# EAGLE design mcc (EAGLE 9.5.1)
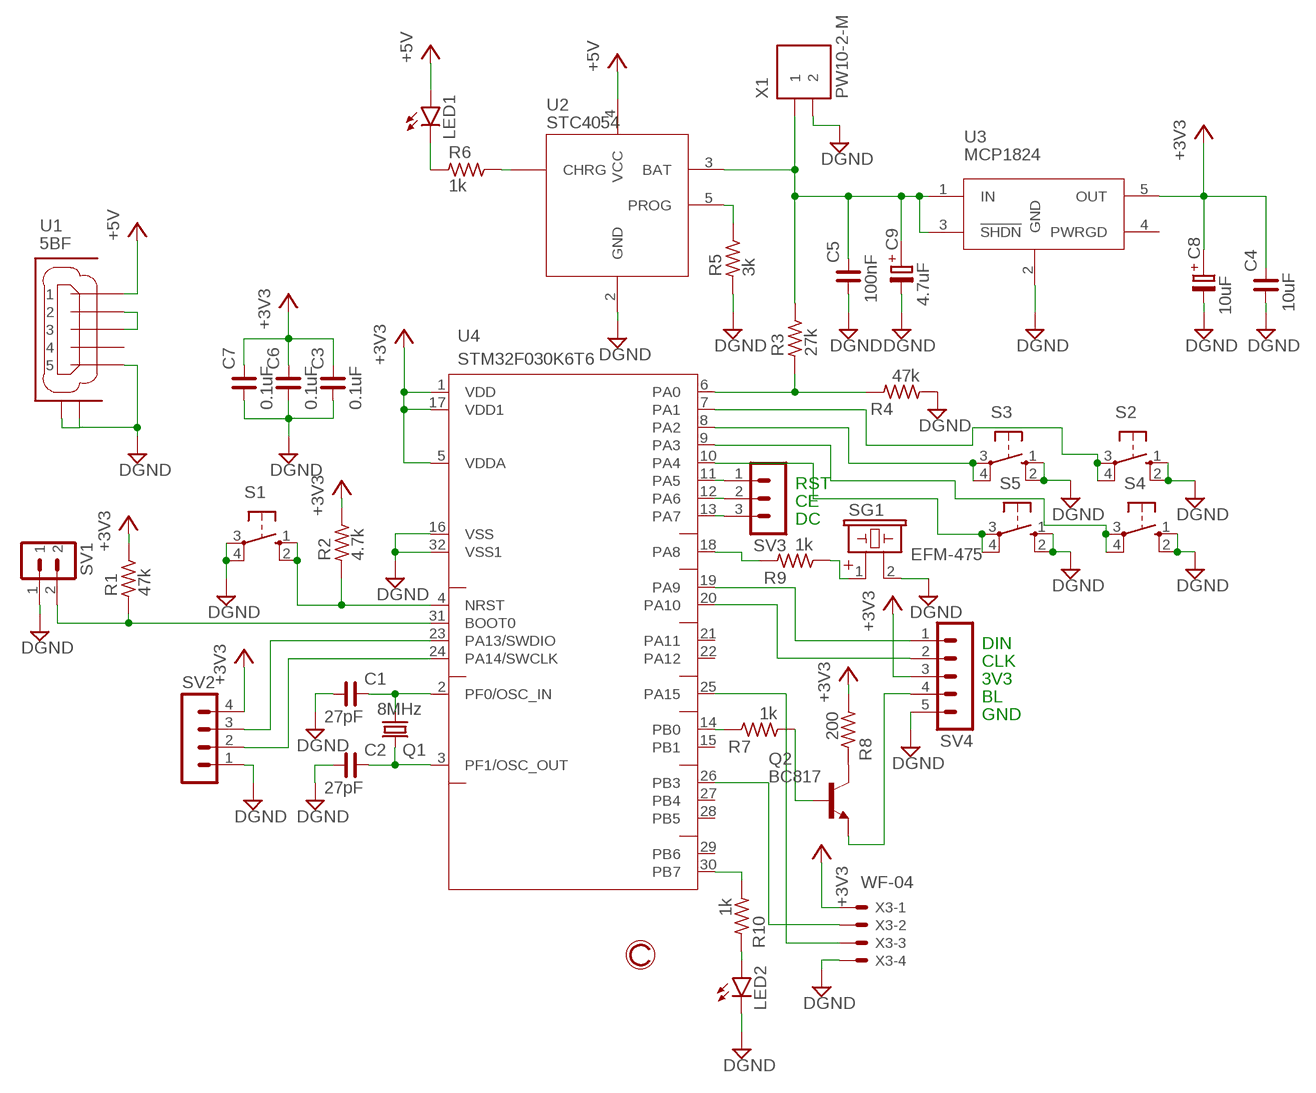
[diagram p0: schematic, sheet 1]

## Parts
C1  27pF  C_0805  [C0805]
C2  27pF  C_0805  [C0805]
C3  0.1uF  C_0805  [C0805]
C4  10uF  C_1206  [C1206]
C5  100nF  C_0805  [C0805]
C6  0.1uF  C_0805  [C0805]
C7  0.1uF  C_0805  [C0805]
C8  10uF  C-PR-SMD-SV-C  [SV-C]
C9  4.7uF  C-PR-SMD-SV-C  [SV-C]
LED1  LEDSML0805  [SML0805]
LED2  LEDSML0805  [SML0805]
Q1  8MHz  CRYSTALHC49UP  [HC49UP]
Q2  BC817  BC817-40SMD  [SOT23-BEC]
R1  47k  R_0805  [R0805]
R2  4.7k  R_0805  [R0805]
R3  27k  R_0805  [R0805]
R4  47k  R_0805  [R0805]
R5  3k  R_0805  [R0805]
R6  1k  R_0805  [R0805]
R7  1k  R_0805  [R0805]
R8  200  R_0805  [R0805]
R9  1k  R_0805  [R0805]
R10  1k  R_0805  [R0805]
S1  10-XX  [B3F-10XX]
S2  10-XX  [B3F-10XX]
S3  10-XX  [B3F-10XX]
S4  10-XX  [B3F-10XX]
S5  10-XX  [B3F-10XX]
SG1  EFM-475  [EFM-472]
SV1  MA02-1  [MA02-1]
SV2  MA04-1  [MA04-1]
SV3  MA03-1  [MA03-1]
SV4  MA05-1  [MA05-1]
U1  5BF  MICRO-USB-5BF  [MICRO-USB-5BF]
U2  STC4054  [SOT23-5L]
U3  MCP1824  [SOT23-5L]
U4  STM32F030K6T6  [LQFP-32]
X1  PW10-2-M  MKS1852-6-0-202  [MKS1852-6-0-202]
X3  WF-04  22-23-2041  [22-23-2041]

## Nets
+3V3: C3.2 C4.2 C6.2 C7.2 C8.+ R1.2 R2.2 R8.1 SV2.4 SV4.3 U3.5(OUT) U4.1(VDD) U4.5(VDDA) U4.17(VDD1) X3.1
BAT: C5.2 C9.+ R3.2 U2.3(BAT) U3.1(IN) U3.3(!SHDN) X1.1
BL: R7.2 U4.14(PB0)
BOOT0: R1.1 SV1.2 U4.31(BOOT0)
BUZZER: R9.2 U4.18(PA8)
CE: SV3.2 U4.12(PA6)
CHRG: R6.2 U2.1(CHRG)
CLK: SV4.2 U4.20(PA10)
DATA: U4.26(PB3) X3.2
DC: SV3.3 U4.13(PA7)
DGND: C1.1 C2.1 C3.1 C4.1 C5.1 C6.1 C7.1 C8.- C9.- LED2.C R4.1 R5.1 S1.3(P) S1.4(P1) S2.1(S) S2.2(S1) S3.1(S) S3.2(S1) S4.1(S) S4.2(S1) S5.1(S) S5.2(S1) SG1.2 SV1.1 SV2.1 SV4.5 U1.5 U1.GND1 U1.GND2 U2.2(GND) U3.2(GND) U4.16(VSS) U4.32(VSS1) X1.2 X3.4
DIN: SV4.1 U4.19(PA9)
DIV_BAT: R3.1 R4.2 U4.6(PA0)
LED2: R10.1 U4.30(PB7)
N$18: U4.25(PA15) X3.3
N$29: U1.2 U1.3
NRST: R2.1 S1.1(S) S1.2(S1) U4.4(NRST)
PF0-OSC_IN: C1.2 Q1.1 U4.2(PF0/OSC_IN)
PF1-OSC_OUT: C2.2 Q1.2 U4.3(PF1/OSC_OUT)
PROG: R5.2 U2.5(PROG)
R_+3V3: Q2.C R8.2
R_BL: Q2.B R7.1
R_BUZZER: R9.1 SG1.1
R_CHRG: LED1.C R6.1
R_LED2: LED2.A R10.2
RST: SV3.1 U4.11(PA5)
S2: S2.3(P) S2.4(P1) U4.7(PA1)
S3: S3.3(P) S3.4(P1) U4.8(PA2)
S4: S4.3(P) S4.4(P1) U4.9(PA3)
S5: S5.3(P) S5.4(P1) U4.10(PA4)
SWCLK: SV2.2 U4.24(PA14/SWCLK)
SWDIO: SV2.3 U4.23(PA13/SWDIO)
VCC: LED1.A U1.1 U2.4(VCC) ; supply symbol labelled +5V
Е_BL: Q2.E SV4.4
Unconnected: U1.4 U3.4(PWRGD) U4.15(PB1) U4.21(PA11) U4.22(PA12) U4.27(PB4) U4.28(PB5) U4.29(PB6)

## Notes on the sheet
- RST
- CE
- DC
- DIN
- CLK
- 3V3
- BL
- GND

## Library data of the parts
C1-C7 = rc-master-smd:C_: NON-POLARIZED CAP
C8 C9 = mcc:C-PR: POLARIZED ELECTROLYTIC/TANTALUM
LED1 LED2 = mcc:LED: LED OSRAM: - CHIPLED LG R971, LG N971, LY N971, LG Q971, LY Q971, LO R971, LY R971 LH N974, LH R974 LS Q976, LO Q976, LY Q976 LO Q996 - Hyper CHIPLED LW Q18S LB Q993, LB Q99A, LB R99A - SideLED LS A670, LO A670, LY A670, LG A670, LP A670 LB A673, LV A673, LT A673, LW A673 LH A674 LY A675 LS A676, LA A676, LO A676, LY A676, LW A676 LS A679, LY A679, LG A679 - Hyper Micro SIDELED® LS Y876, LA Y876, LO Y876, LY Y876 LT Y87S - SmartLED LW L88C, LW L88S LB L89C, LB L89S, LG L890 LS L89K, LO L89K, LY L89K LS L896, LA L896, LO L896, LY L896 - TOPLED LS T670, LO T670, LY T670, LG T670, LP T670 LSG T670, LSP T670, LSY T670, LOP T670, LYG T670 LG T671, LOG T671, LSG T671 LB T673, LV T673, LT T673, LW T673 LH T674 LS T676, LA T676, LO T676, LY T676, LB T676, LH T676, LSB T676, LW T676 LB T67C, LV T67C, LT T67C, LS T67K, LO T67K, LY T67K, LW E67C LS E67B, LA E67B, LO E67B, LY E67B, LB E67C, LV E67C, LT E67C LW T67C LS T679, LY T679, LG T679 LS T770, LO T770, LY T770, LG T770, LP T770 LB T773, LV T773, LT T773, LW T773 LH T774 LS E675, LA E675, LY E675, LS T675 LS T776, LA T776, LO T776, LY T776, LB T776 LHGB T686 LT T68C, LB T68C - Hyper Mini TOPLED® LB M676 - Mini TOPLED Santana® LG M470 LS M47K, LO M47K, LY M47K Source: http://www.osram.convergy.de LUXEON: - LUMILED® LXK2-PW12-R00, LXK2-PW12-S00, LXK2-PW14-U00, LXK2-PW14-V00 LXK2-PM12-R00, LXK2-PM12-S00, LXK2-PM14-U00 LXK2-PE12-Q00, LXK2-PE12-R00, LXK2-PE12-S00, LXK2-PE14-T00, LXK2-PE14-U00 LXK2-PB12-K00, LXK2-PB12-L00, LXK2-PB12-M00, LXK2-PB14-N00, LXK2-PB14-P00, LXK2-PB14-Q00 LXK2-PR12-L00, LXK2-PR12-M00, LXK2-PR14-Q00, LXK2-PR14-R00 LXK2-PD12-Q00, LXK2-PD12-R00, LXK2-PD12-S00 LXK2-PH12-R00, LXK2-PH12-S00 LXK2-PL12-P00, LXK2-PL12-Q00, LXK2-PL12-R00 Source: www.luxeon.com KINGBRIGHT: KA-3528ASYC Source: www.kingbright.com
Q1 = mcc:CRYSTAL: CRYSTAL; OC_FARNELL: unknown; OC_NEWARK: unknown
Q2 = mcc:BC817*: NPN Transistor
R1-R10 = rc-master-smd:R_: RESISTOR
S1-S5 = mcc:10-XX: OMRON SWITCH; MPN: B3F-1000; OC_FARNELL: 176432; OC_NEWARK: 36M3542
SG1 = mcc:EFM-475: BUZZER Source: Buerklin
SV1 = mcc:MA02-1: PIN HEADER
SV2 = mcc:MA04-1: PIN HEADER; OC_FARNELL: unknown; OC_NEWARK: unknown
SV3 = mcc:MA03-1: PIN HEADER; OC_FARNELL: unknown; OC_NEWARK: unknown
SV4 = mcc:MA05-1: PIN HEADER; OC_FARNELL: unknown; OC_NEWARK: unknown
U1 = mcc:MICRO-USB-5BF: Micro USB B connector
U2 = mcc:STC4054
U3 = mcc:MCP1824
U4 = mcc:STM32F030K6T6
X1 = mcc:MKS1852-6-0-202: Serie MKS 1850 Lötstifte In-line, Raster 2.5 mm, Stiftwannen, stehend, mit Rastlasche Source: http://www.stocko.de/de/index.php?seite=ka_rfk2_mks1850.html&rubrik=Katalog+-+RFK+2 rfk_1850.pdf; OC_FARNELL: unknown; OC_NEWARK: unknown
X3 = mcc:22-23-2041: .100" (2.54mm) Center Header - 4 Pin; MF: MOLEX; MPN: 22-23-2041; OC_FARNELL: 1462920; OC_NEWARK: 38C0355

## Board
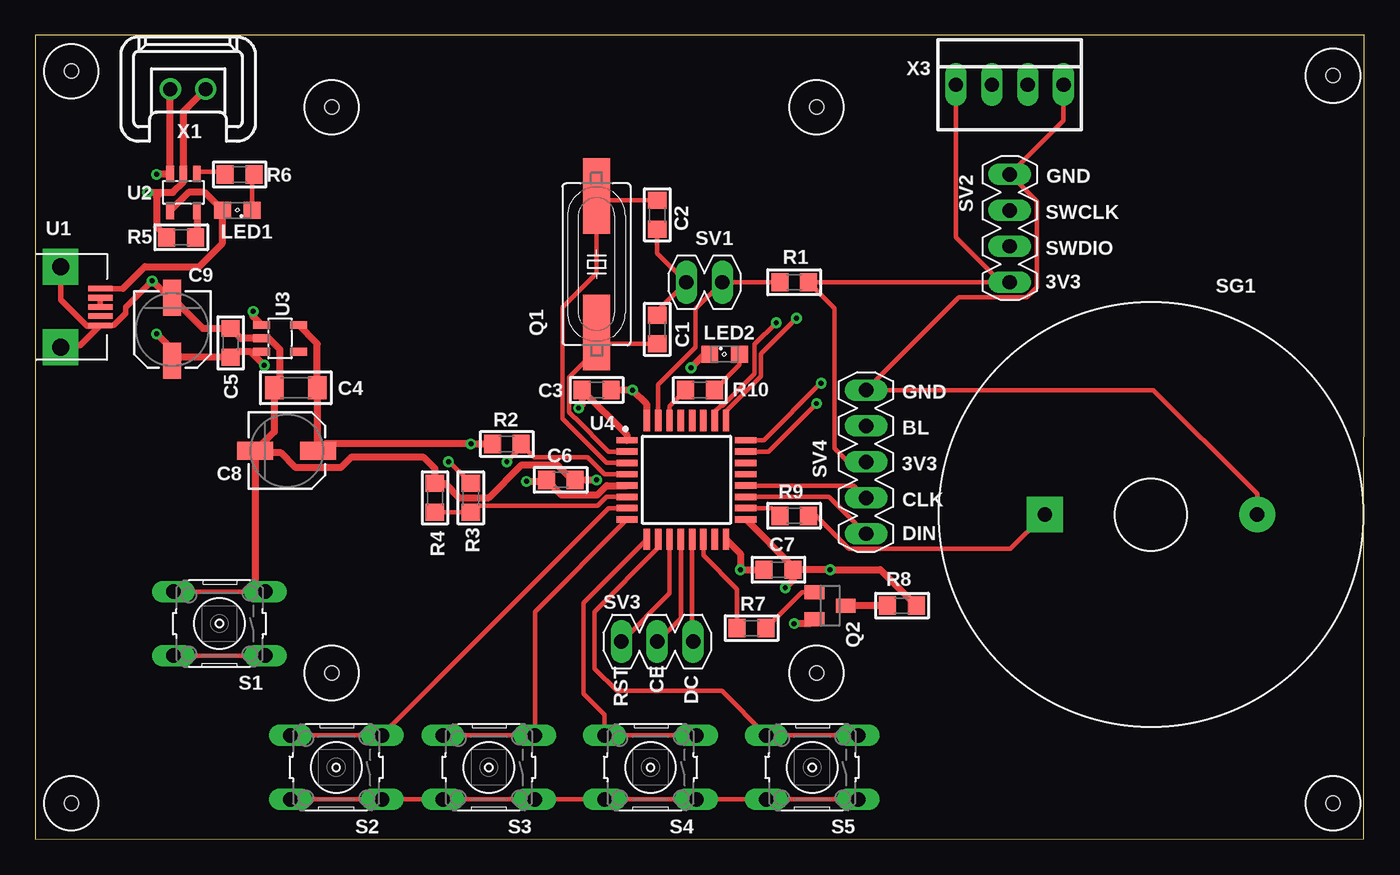
[diagram p1: board, top side]
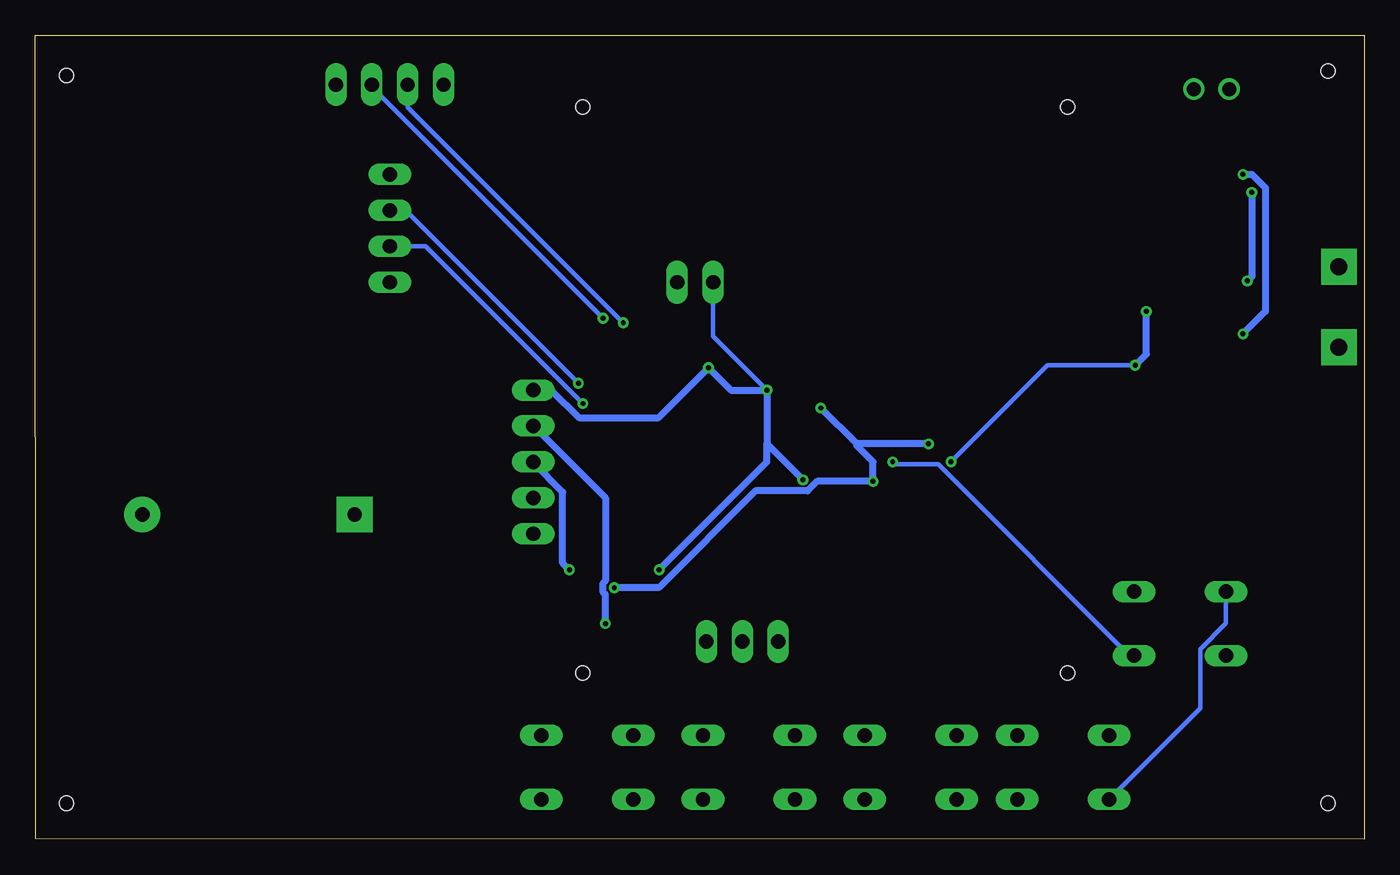
[diagram p2: board, bottom side, seen from below]

Size 93.96 x 56.82 mm. Coordinates in mm from the lower left corner, seen from the top.
Outline: 0,0 93.94,0.04 93.96,56.82 0,56.82 0,0
Copper layers (1*16): Top 0.035mm / dielectric 1.5mm / Bottom 0.035mm
Design rules "default": minimum track width 6mil, minimum drill 0.35mm, track to track 6mil, track to pad 6mil, pad to pad 6mil, via to via 6mil, smd to smd 6mil, copper to edge 40mil, drill to drill 6mil, minimum pad ring 10mil, minimum via ring 8mil, stop-mask expansion 4mil, vias tented up to drill 0mil, thermal gap 10mil
Holes 1 mm at 20.96,11.75 55.25,11.75 55.25,51.75 20.96,51.75 2.54,54.29 91.76,53.97 91.76,2.54 2.54,2.54

### Footprints (pad centres in the part's own frame; a part is rotated, then mirrored left to right if it is on the bottom)
C0805 = smd 1.2 x 1.3: 1 -1.016,0; 2 1.016,0
C1206 = smd 1.3 x 1.6: 1 -1.524,0; 2 1.524,0
SV-C = smd 2.54 x 1.27: + -2.223,0; - 2.223,0
SML0805 = smd 1.2 x 1.2: A 1.05,0; C -1.05,0
HC49UP = smd 5.334 x 1.93: 1 -4.826,0; 2 4.826,0
SOT23-BEC = smd 1 x 1.4: B -0.95,-1.1; C 0,1.1; E 0.95,-1.1
R0805 = smd 1.2 x 1.3: 1 -1.016,0; 2 1.016,0
B3F-10XX = drill 1.016 long: 1 -3.251,2.261; 2 3.251,2.261; 3 -3.251,-2.261; 4 3.251,-2.261
EFM-472 = drill 1 pad 2.54 square: 1 -7.504,0 | drill 1 pad 2.54: 2 7.504,0
MA02-1 = drill 1.016 long: 1 -2.54,0; 2 0,0
MA04-1 = drill 1.016 long: 1 -3.81,0; 2 -1.27,0; 3 1.27,0; 4 3.81,0
MA03-1 = drill 1.016 long: 1 -2.54,0; 2 0,0; 3 2.54,0
MA05-1 = drill 1.016 long: 1 -5.08,0; 2 -2.54,0; 3 0,0; 4 2.54,0; 5 5.08,0
MICRO-USB-5BF = smd 0.4 x 1.75: 1 -1.3,4.525; 2 -0.65,4.525; 3 0,4.525; 4 0.65,4.525; 5 1.3,4.525 | drill 1.2 pad 2.54 square: GND1 -2.855,1.7; GND2 2.855,1.7
SOT23-5L = smd 0.55 x 1.2: 1 -0.95,-1.3; 2 0,-1.3; 3 0.95,-1.3; 4 0.95,1.3; 5 -0.95,1.3
LQFP-32 = smd 0.45 x 1.5: 1 2.28,0.88; 2 3.08,0.88; 3 3.88,0.88; 4 4.68,0.88; 5 5.48,0.88; 6 6.28,0.88; 7 7.08,0.88; 8 7.88,0.88; 17 7.88,9.28; 18 7.08,9.28; 19 6.28,9.28; 20 5.48,9.28; 21 4.68,9.28; 22 3.88,9.28; 23 3.08,9.28; 24 2.28,9.28 | smd 1.5 x 0.45: 9 9.28,2.28; 10 9.28,3.08; 11 9.28,3.88; 12 9.28,4.68; 13 9.28,5.48; 14 9.28,6.28; 15 9.28,7.08; 16 9.28,7.88; 25 0.88,7.88; 26 0.88,7.08; 27 0.88,6.28; 28 0.88,5.48; 29 0.88,4.68; 30 0.88,3.88; 31 0.88,3.08; 32 0.88,2.28
MKS1852-6-0-202 = drill 1 pad 1.422: 1 -1.25,0; 2 1.25,0
22-23-2041 = drill 1 long: 1 -3.81,0; 2 -1.27,0; 3 1.27,0; 4 3.81,0

### Placement (x,y rotation side)
C1  43.97,36.04 270 top
C2  43.97,44.13 90 top
C3  39.69,31.75 180 top
C4  18.42,31.91 0 top
C5  13.81,35.08 270 top
C6  37.15,25.4 180 top
C7  52.55,19.05 0 top
C8  17.78,27.46 180 top
C9  9.68,36.04 90 top
LED1  14.29,44.45 180 top
LED2  48.74,34.29 0 top
Q1  39.69,40.64 90 top
Q2  56.2,16.51 270 top
R1  53.66,39.37 0 top
R2  33.34,27.94 180 top
R3  30.8,24.13 90 top
R4  28.26,24.13 270 top
R5  10.32,42.55 0 top
R6  14.45,46.99 180 top
R7  50.64,14.92 180 top
R8  61.28,16.51 180 top
R9  53.66,22.86 180 top
R10  46.99,31.75 0 top
S1  13.02,15.24 180 top
S2  21.27,5.08 180 top
S3  32.07,5.08 180 top
S4  43.5,5.08 180 top
S5  54.93,5.08 180 top
SG1  78.89,22.95 0 top
SV1  48.58,39.37 0 top
SV2  68.9,43.18 270 top
SV3  43.97,13.97 0 top
SV4  58.74,26.67 90 top
U1  0.08,37.62 270 top
U2  10.48,45.72 180 top
U3  17.3,35.4 270 top
U4  40.96,30.48 270 top
X1  10.79,53.02 0 top
X3  68.9,53.34 0 top

### Tracks (layer width: path | path; a pad name or v marks a point on that pad's centre or on a via)
+3V3  (via drill 0.35)
  Top 0.152: 59.75,19.05 59.8,19 | 36.24,25.29 C6.2
  Top 0.305: SV4.3 57.47,26.67 56.52,27.62 56.52,37.53 R1.2 SV2.4 68.26,39.37 65.09,42.55 X3.1
  Top 0.508: v38.42,30.48 38.67,30.73 C3.2 41.84,28.58 U4.1 | v34.72,25.29 36.24,25.29 | U4.5 40.4,25 39.74,24.34 37.19,24.34 C6.2 | C7.2 53.56,18.32 v53.02,17.78 | 59.8,19 R8.1 | U3.5 19.94,35.02 C4.2 19.94,27.53 C8.+ 20.48,27.94 v30.8,27.94 R2.2 | U4.17 53.56,19.27 C7.2 | C7.2 v56.2,19.05 59.75,19.05
  Bottom 0.152: 35.88,27.94 34.72,26.78 34.72,26.67 | 58.74,26.61 SV4.3
  Bottom 0.508: v56.2,19.05 56.67,19.52 56.67,24.54 58.74,26.61 | 35.88,27.94 v38.42,30.48 | 35.88,27.94 35.88,27.83 34.72,26.67 v34.72,25.29 38.69,25.29 39.36,24.61 43.04,24.61 49.88,17.78 v53.02,17.78 | v30.8,27.94 35.88,27.94
BAT  (via drill 0.35)
  Top 0.152: 30.51,25.43 R3.2
  Top 0.305: v29.21,26.68 29.26,26.68 30.51,25.43
  Top 0.508: 9.94,34.07 C5.2 14.19,34.45 15.24,34.45 | 9.94,34.07 C9.+ | 15.24,34.45 U3.3 | v16.19,33.5 15.24,34.45 | v8.57,35.72 9.94,34.35 9.94,34.07 | v15.4,37.31 15.4,36.96 U3.1 | v8.57,46.99 9.5,46.99 U2.3 9.53,53 X1.1
  Bottom 0.305: v16.19,33.5 22.4,33.5 v29.21,26.68
  Bottom 0.508: v8.57,46.99 7.94,46.99 6.99,46.04 6.99,37.31 v8.57,35.72 | v16.19,33.5 15.4,34.29 v15.4,37.31
BL
  Top 0.305: R7.2 49.63,17.68 47.24,20.07 U4.14
BOOT0
  Top 0.305: U4.31 44.04,32.13 46.69,34.78 46.69,37.48 SV1.2 R1.1
BUZZER
  Top 0.152: 52.51,22.99 R9.2
  Top 0.305: U4.18 52.1,23.4 52.51,22.99
CE
  Top 0.305: U4.12 45.64,15.63 SV3.2
CHRG
  Top 0.305: U2.1 11.59,47.18 13.24,47.18 R6.2
CLK
  Top 0.305: U4.20 57.87,25 SV4.2
DATA  (via drill 0.35)
  Top 0.305: v52.39,36.51 50.85,34.98 50.85,32.91 48.59,30.66 48.49,30.66 48.04,30.21 U4.26
  Bottom 0.305: v52.39,36.51 67.63,51.75 X3.2
DC
  Top 0.305: U4.13 46.44,14.05 SV3.3
DGND  (via drill 0.35)
  Top 0.152: 38.42,25.4 C6.1
  Top 0.305: S2.2 S2.1 S3.2 S3.1 S4.2 S4.1 S5.2 S5.1 | S1.3 S1.4 | X3.4 72.71,50.8 SV2.1 70.8,45.08 70.8,39 70.1,38.3 65.29,38.3 SV4.5 79.06,31.75 86,24.8 86.39,24.42 SG1.2 | C2.1 43.97,41.43 SV1.1 43.97,37.31 C1.1
  Top 0.406: v8.25,39.47 6.4,37.61 6.4,37.17 5.55,36.32 U1.5 | U1.5 3.15,34.87 U1.GND2 | U1.5 4.54,36.26 3.66,36.26 1.78,38.14 U1.GND1
  Top 0.508: 8.89,45.72 9.71,45.72 10.48,46.48 U2.2 10.48,51.45 X1.2 | v7.94,45.72 8.89,45.72 | 38.42,25.4 37.96,25.4 36.9,26.46 34.39,26.46 32.08,24.14 29.98,24.14 28.97,25.15 R4.1 28.26,26.19 27.46,26.99 22.32,26.99 21.6,26.26 18.41,26.26 17.36,27.3 15.72,27.3 15.56,27.15 | C9.- 9.92,38.02 | 9.92,38.02 11.84,36.1 13.72,36.1 13.81,36.2 C5.1 14.51,35.4 U3.2 16.51,35.4 17.3,34.61 17.3,32.32 C4.1 16.89,28.8 C8.- 15.56,27.15 | v8.25,39.47 9.7,38.02 9.92,38.02 | 15.56,27.15 15.56,18.21 S1.3 | C6.1 v39.69,25.4 | U4.32 43.24,30.74 v42.23,31.75 C3.1 | C7.1 v49.85,19.05 49.85,20.19 U4.16 | v46.36,33.33 47.33,34.29 LED2.C | 8.89,45.72 8.57,45.4 8.57,43.27 R5.1
  Bottom 0.152: v46.36,33.33 46.36,33.33
  Bottom 0.305: S1.4 9.77,15.25 11.6,13.42 11.6,9.25 S2.2 | SV1.1 46.04,35.56 v42.23,31.75
  Bottom 0.508: v7.94,45.72 7.94,39.78 v8.25,39.47 | 42.23,27.94 v42.23,31.75 44.79,31.75 v46.36,33.33 | 42.23,27.94 v39.69,25.4 | v49.85,19.05 42.23,26.67 42.23,27.94 | 46.36,33.33 49.89,29.8 55.53,29.8 57.48,31.75 SV4.5
DIN
  Top 0.305: U4.19 56.13,24.2 SV4.1
DIV_BAT
  Top 0.305: R4.2 R3.1 31.26,23.58 39.77,23.58 40.39,24.2 U4.6
LED2
  Top 0.305: U4.30 44.84,30.61 R10.1
N$18  (via drill 0.35 pad 0.6)
  Top 0.305: v53.82,36.83 51.31,34.32 51.31,32.72 48.84,30.25 U4.25
  Bottom 0.305: X3.3 70.17,53.18 v53.82,36.83
N$29
  Top 0.406: U1.2 U1.3
NRST  (via drill 0.35)
  Top 0.305: v33.34,26.67 34.35,27.69 R2.1 35.28,27.02 39.04,27.02 40.25,25.8 U4.4 | S1.1 S1.2
  Bottom 0.305: v33.34,26.67 33.18,26.51 30.12,26.51 16.59,12.98 S1.1
PF0-OSC_IN
  Top 0.152: 39.69,34.61 Q1.1
  Top 0.305: U4.2 40.55,27.4 38.15,29.8 38.13,29.8 37.73,30.2 37.73,32.66 39.69,34.61 | Q1.1 40.48,35.02 C1.2
PF1-OSC_OUT
  Top 0.305: U4.3 40.39,26.6 37.28,29.71 37.28,37.59 39.69,40 Q1.2 40,45.15 C2.2
PROG
  Top 0.508: U2.5 11.43,42.64 R5.2
R_+3V3
  Top 0.508: R8.2 Q2.C
R_BL
  Top 0.305: R7.1 54.19,17.46 Q2.B
R_BUZZER
  Top 0.305: R9.1 55.2,22.86 57.53,20.52 67.48,20.52 67.95,20.52 68.96,20.52 SG1.1
R_CHRG
  Top 0.305: LED1.C 15.34,46.86 R6.1
R_LED2
  Top 0.305: LED2.A 49.79,33.53 R10.2
RST
  Top 0.305: SV3.1 44.84,17.37 U4.11
S2
  Top 0.305: S2.3 24.49,7.34 | 24.49,7.34 S2.4 | 24.49,7.34 40.55,23.4 U4.7
S3
  Top 0.305: S3.4 S3.3 35.32,16.08 U4.8
S4
  Top 0.305: U4.9 38.75,16.72 38.75,10.29 40.25,8.8 S4.4 S4.3
S5
  Top 0.152: 44.04,20.7 U4.10
  Top 0.305: S5.3 S5.4 48.54,10.48 41.12,10.48 39.53,12.06 39.53,16.09 44.04,20.59 44.04,20.7
SWCLK  (via drill 0.35)
  Top 0.305: v55.56,32.23 55.56,32.25 51.51,28.2 U4.24
  Bottom 0.305: v55.56,32.23 67.79,44.45 SV2.2
SWDIO  (via drill 0.35)
  Top 0.305: v55.25,30.8 51.85,27.4 U4.23
  Bottom 0.305: v55.25,30.8 66.36,41.91 SV2.3
VCC
  Top 0.406: U1.1 6.19,38.92
  Top 0.508: 6.19,38.92 7.75,40.48 11.59,40.48 13.24,42.13 LED1.A 11.97,45.72 10.83,45.72 U2.4
Е_BL  (via drill 0.35)
  Top 0.508: Q2.E 54.78,15.24 v53.66,15.24
  Bottom 0.508: v53.66,15.24 53.66,17.3 53.81,17.45 53.81,18.1 53.66,18.25 53.66,24.13 SV4.4

### Text on the board
tPlace: GND | SWCLK | SWDIO | 3V3 | GND | BL | 3V3 | CLK | DIN | DC | CE | RST
tValues: MCC rev1.0 | © C1ewd